# EAGLE design drawerlights (EAGLE 8.7.1)
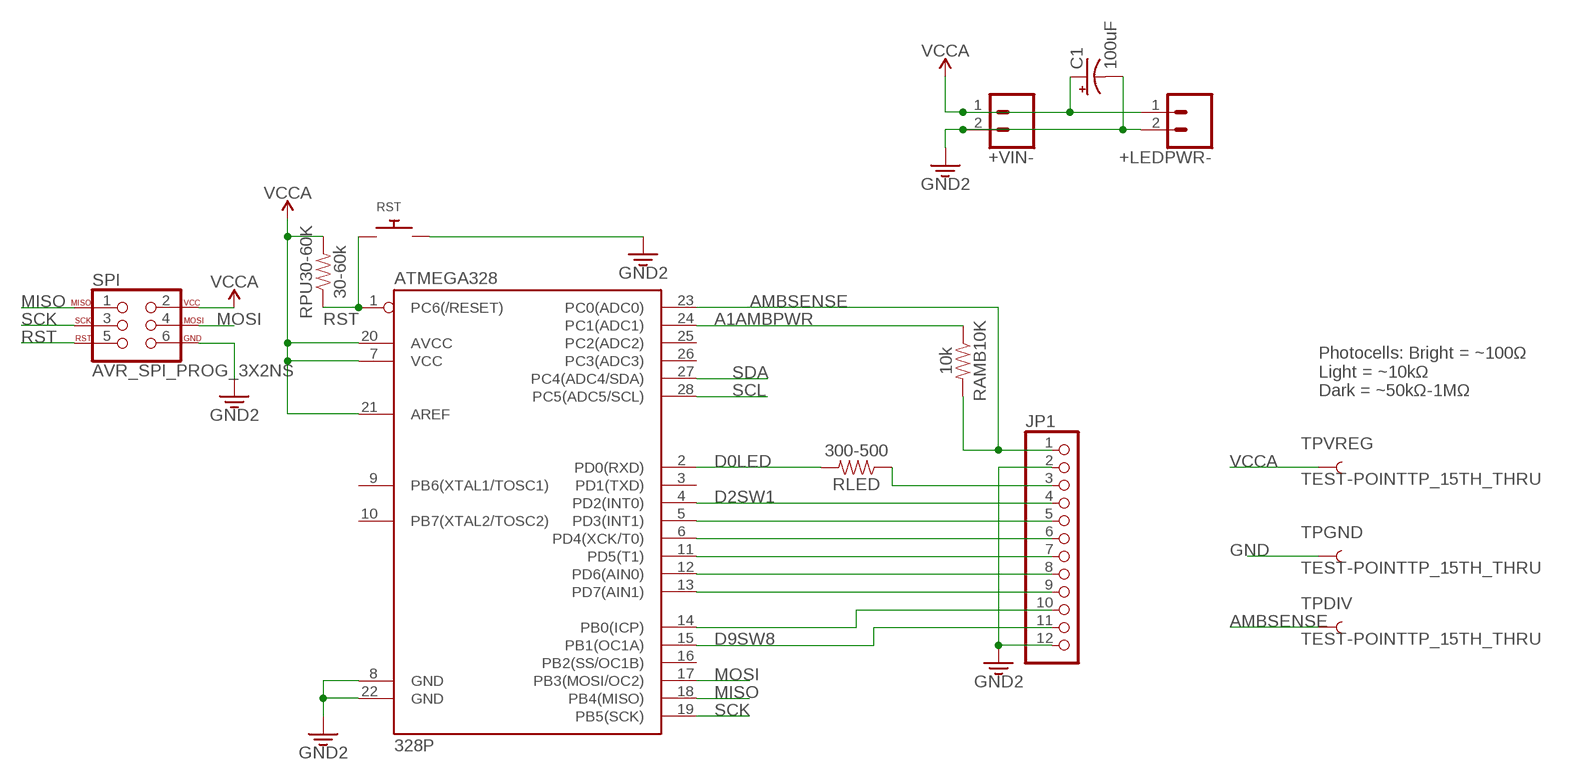
[diagram p0: schematic, sheet 1]

## Parts
+LEDPWR-  CONN_02  [1X02]
+VIN-  CONN_02  [1X02]
ATMEGA328  328P  ATMEGA328P_PDIP  [DIP28]
C1  100uF  100UF-POLAR-RADIAL-2.5MM-25V-20%  [CPOL-RADIAL-2.5MM-6.5MM]
JP1  PINHD-1X12-CB  [1X12-CB]
RAMB10K  10k  10KOHM-HORIZ-1/4W-1%  [AXIAL-0.3]
RLED  300-500  330OHM-HORIZ-1/10W-5%  [AXIAL-0.3]
RPU30-60K  30-60k  330OHM-HORIZ-1/10W-5%  [AXIAL-0.3]
RST  SWITCH_PUSHBUTTONEVQ-PE  [TACT_PANA-EVQ]
SPI  AVR_SPI_PROG_3X2NS  [2X3-NS]
TPDIV  TEST-POINTTP_15TH_THRU  [TP_15TH]
TPGND  TEST-POINTTP_15TH_THRU  [TP_15TH]
TPVREG  TEST-POINTTP_15TH_THRU  [TP_15TH]

## Nets
A1AMBPWR: ATMEGA328.24(PC1(ADC1)) RAMB10K.P$1
AMBSENSE: ATMEGA328.23(PC0(ADC0)) JP1.1 RAMB10K.P$2 TPDIV.P$1
D0LED: ATMEGA328.2(PD0(RXD)) RLED.P$2
D2SW1: ATMEGA328.4(PD2(INT0)) JP1.4
D9SW8: ATMEGA328.15(PB1(OC1A)) JP1.11
GND [power]: +LEDPWR-.2 +VIN-.2 ATMEGA328.8(GND) ATMEGA328.22(GND) C1.2(-) JP1.2 JP1.12 RST.P$2 SPI.6 TPGND.P$1 ; supply symbol labelled GND2
MISO: ATMEGA328.18(PB4(MISO)) SPI.1
MOSI: ATMEGA328.17(PB3(MOSI/OC2)) SPI.4
N$1: JP1.3 RLED.P$1
N$2: ATMEGA328.5(PD3(INT1)) JP1.5
N$3: ATMEGA328.6(PD4(XCK/T0)) JP1.6
N$4: ATMEGA328.11(PD5(T1)) JP1.7
N$5: ATMEGA328.12(PD6(AIN0)) JP1.8
N$6: ATMEGA328.13(PD7(AIN1)) JP1.9
N$7: ATMEGA328.14(PB0(ICP)) JP1.10
RST: ATMEGA328.1(PC6(/RESET)) RPU30-60K.P$1 RST.P$1 SPI.5
SCK: ATMEGA328.19(PB5(SCK)) SPI.3
SCL: ATMEGA328.28(PC5(ADC5/SCL))
SDA: ATMEGA328.27(PC4(ADC4/SDA))
VCCA [power]: +LEDPWR-.1 +VIN-.1 ATMEGA328.7(VCC) ATMEGA328.20(AVCC) ATMEGA328.21(AREF) C1.1(+) RPU30-60K.P$2 SPI.2 TPVREG.P$1
Unconnected: ATMEGA328.3(PD1(TXD)) ATMEGA328.9(PB6(XTAL1/TOSC1)) ATMEGA328.10(PB7(XTAL2/TOSC2)) ATMEGA328.16(PB2(SS/OC1B)) ATMEGA328.25(PC2(ADC2)) ATMEGA328.26(PC3(ADC3))

## Notes on the sheet
- Photocells: Bright = ~100Ω
  Light = ~10kΩ
  Dark = ~50kΩ-1MΩ

## Library data of the parts
+LEDPWR- +VIN- = SparkFun-Connectors:CONN_02: Multi connection point. Often used as Generic Header-pin footprint for 0.1 inch spaced/style header connections On any of the 0.1 inch spaced packages, you can populate with these: Break Away Headers - Straight <https://www.sparkfun.com/products/116> (PRT-00116) Break Away Male Headers - Right Angle <https://www.sparkfun.com/products/553> (PRT-00553) Female Headers <https://www.sparkfun.com/products/115> (PRT-00115) Break Away Headers - Machine Pin <https://www.sparkfun.com/products/117> (PRT-00117) Break Away Female Headers - Swiss Machine Pin <https://www.sparkfun.com/products/743> (PRT-00743) For SCREWTERMINALS and SPRING TERMINALS visit here: Screw Terimnals on SparkFun.com <https://www.sparkfun.com/search/results?term=Screw+Terminals> (5mm/3.5mm/2.54mm spacing) This device is also useful as a general connection point to wire up your design to another part of your project. Our various solder wires solder well into these plated through hole pads. Hook-Up Wire - Assortment (Stranded, 22 AWG) <https://www.sparkfun.com/products/11375> (PRT-11375) Hook-Up Wire - Assortment (Solid Core, 22 AWG) <https://www.sparkfun.com/products/11367> (PRT-11367) View the entire wire category on our website here <https://www.sparkfun.com/categories/141> Special notes: Molex polarized connector foot print use with: PRT-08233 with associated crimp pins and housings. 2.54_SCREWTERM for use with PRT-10571. 3.5mm Screw Terminal footprints for PRT-08084 5mm Screw Terminal footprints for use with PRT-08432
ATMEGA328 = SparkFun-IC-Microcontroller:ATMEGA328P_PDIP: Atmel 328P Through hole ATMEGA328P uC used in the Arduino 32kb flash, 1k EEPROM, 2k SRAM Datasheet <http://www.sparkfun.com/datasheets/Components/SMD/ATMega328.pdf> SparkFun Products Storefront component: AVR 28 Pin 20MHz 32K 6A/D - ATMega328P <https://www.sparkfun.com/products/9061> (COM-09061) SparkFun Simon Says - Through-Hole Soldering Kit <https://www.sparkfun.com/products/10547> (KIT-10547) SparkFun Learn to Solder - Simon Says <https://www.sparkfun.com/products/13708> (KIT-13708) SparkFun BigTime Watch Kit <https://www.sparkfun.com/products/11734> (KIT-11734) SparkFun ClockIt <https://www.sparkfun.com/products/10930> (KIT-10930) SparkFun Serial Enabled LCD Kit <https://www.sparkfun.com/products/10097> (LCD-10097) SparkFun Simon Tilts - Through Hole Soldering Kit <https://www.sparkfun.com/products/12634> (KIT-12634) SparkFun Frequency Counter Kit <https://www.sparkfun.com/products/10140> (KIT-10140) FabFM Radio Kit <https://www.sparkfun.com/products/11043> (KIT-11043) SparkFun Binary Blaster Kit <https://www.sparkfun.com/products/12037> (KIT-12037) SparkFun Metro-Gnome <https://www.sparkfun.com/products/9236> (KIT-09236) ATmega328 with Arduino Optiboot (Uno) <https://www.sparkfun.com/products/10524> (DEV-10524); PROD_ID: IC-09136
C1 = SparkFun-Capacitors:100UF-POLAR: 100µF polarized capacitors A capacitor is a passive two-terminal electrical component used to store electrical energy temporarily in an electric field.; PROD_ID: CAP-08439
JP1 = adafruit:PINHD-1X12: PIN HEADER
RAMB10K = SparkFun-Resistors:10KOHM: 10kΩ resistor A resistor is a passive two-terminal electrical component that implements electrical resistance as a circuit element. Resistors act to reduce current flow, and, at the same time, act to lower voltage levels within circuits. - Wikipedia; PROD_ID: RES-12183
RLED RPU30-60K = SparkFun-Resistors:330OHM: 330Ω resistor A resistor is a passive two-terminal electrical component that implements electrical resistance as a circuit element. Resistors act to reduce current flow, and, at the same time, act to lower voltage levels within circuits. - Wikipedia; PROD_ID: RES-8371; VALUE: 330
RST = adafruit:SWITCH_PUSHBUTTON: Buttons SOFTTOUCHSMD_SJ - Soft touch temporary push button (Super Junk Akihabara) Compatible with SKPMANE010 [Mouser: 688-SKPMAN] C&K_KSS = Digikey: KSS221GLFS
SPI = SparkFun-Connectors:AVR_SPI_PROG_3X2: AVR ISP 6 Pin This is the reduced ISP connector for AVR programming. Common on Arduino. This footprint will take up less PCB space and can be used with a 10-pin to 6-pin adapter such as SKU: BOB-08508 **Special note about "TEST_POINT" package. The stop mask is on the top side, so if you want your programming test points to be on the bottom of your board, make sure to place this package on the bottom side of the board. This also ensure that the orientation to program from the bottom side will be correct. SparkFun Products: SparkFun ISP Pogo Adapter <https://www.sparkfun.com/products/11591> - NS Tiny AVR Programmer <https://www.sparkfun.com/products/11801> -PTH
TPDIV TPGND TPVREG = SparkFun-Connectors:TEST-POINT: SparkFun Test Points Bare copper test points for troubleshooting or In-Circuit-Testing. These are used by our Production team for verifying production board runs using pogo-pins on test beds. SparkFun Products: SparkFun LSM9DS1 Breakout <https://www.sparkfun.com/products/13284> SparkFun PSOC <https://www.sparkfun.com/products/13714> SparkFun Load Cell Amplifier <https://www.sparkfun.com/products/13879>

## Net classes
1 power: width 0.406 mm

## Board
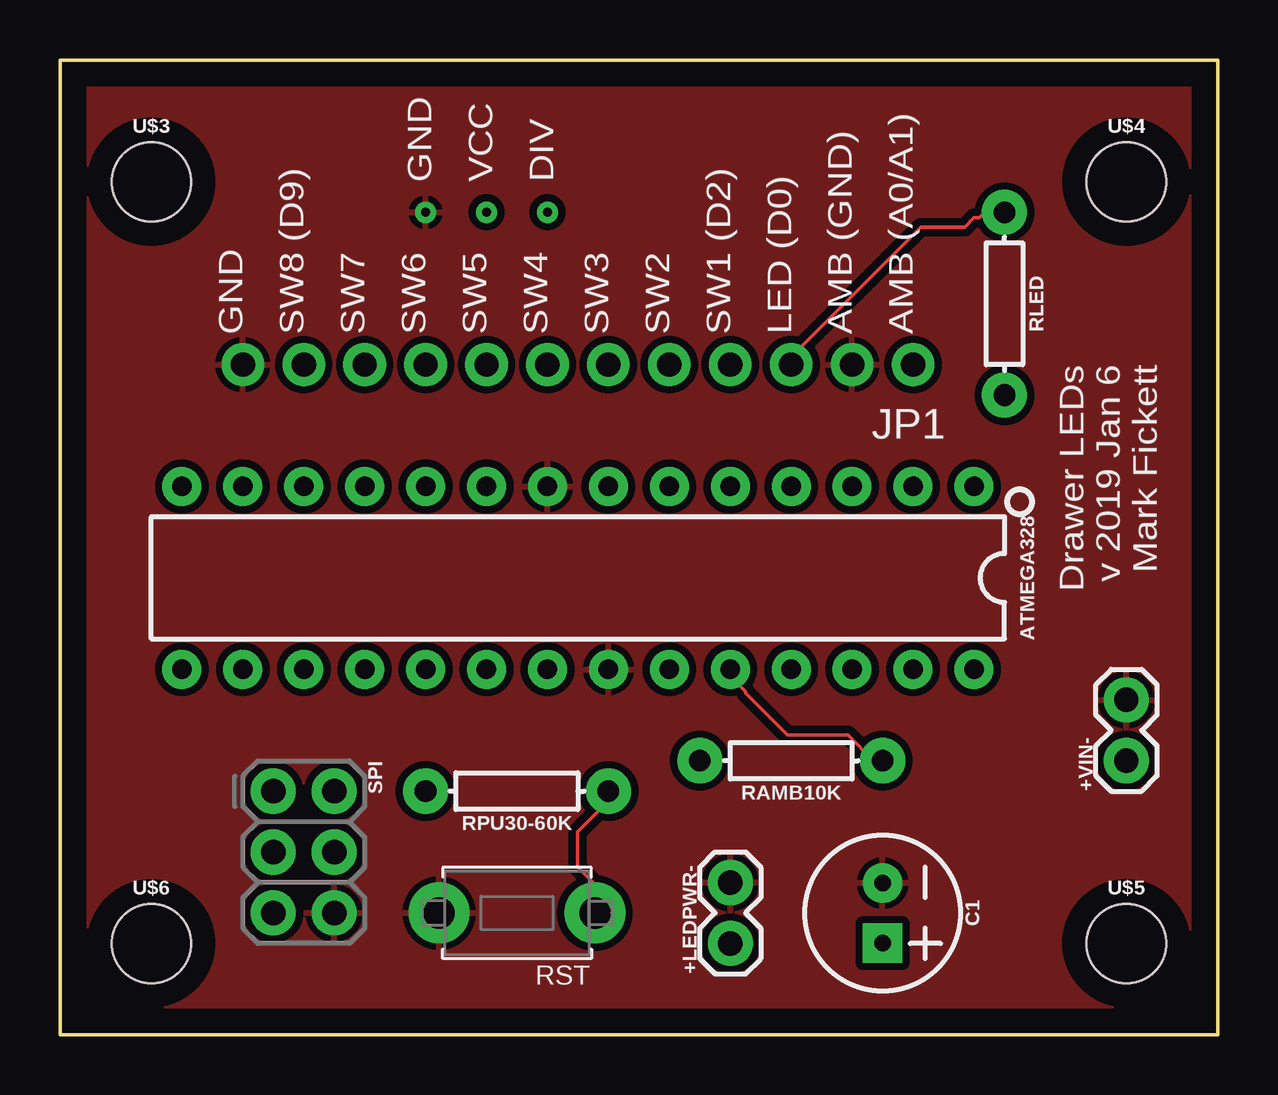
[diagram p1: board, top side]
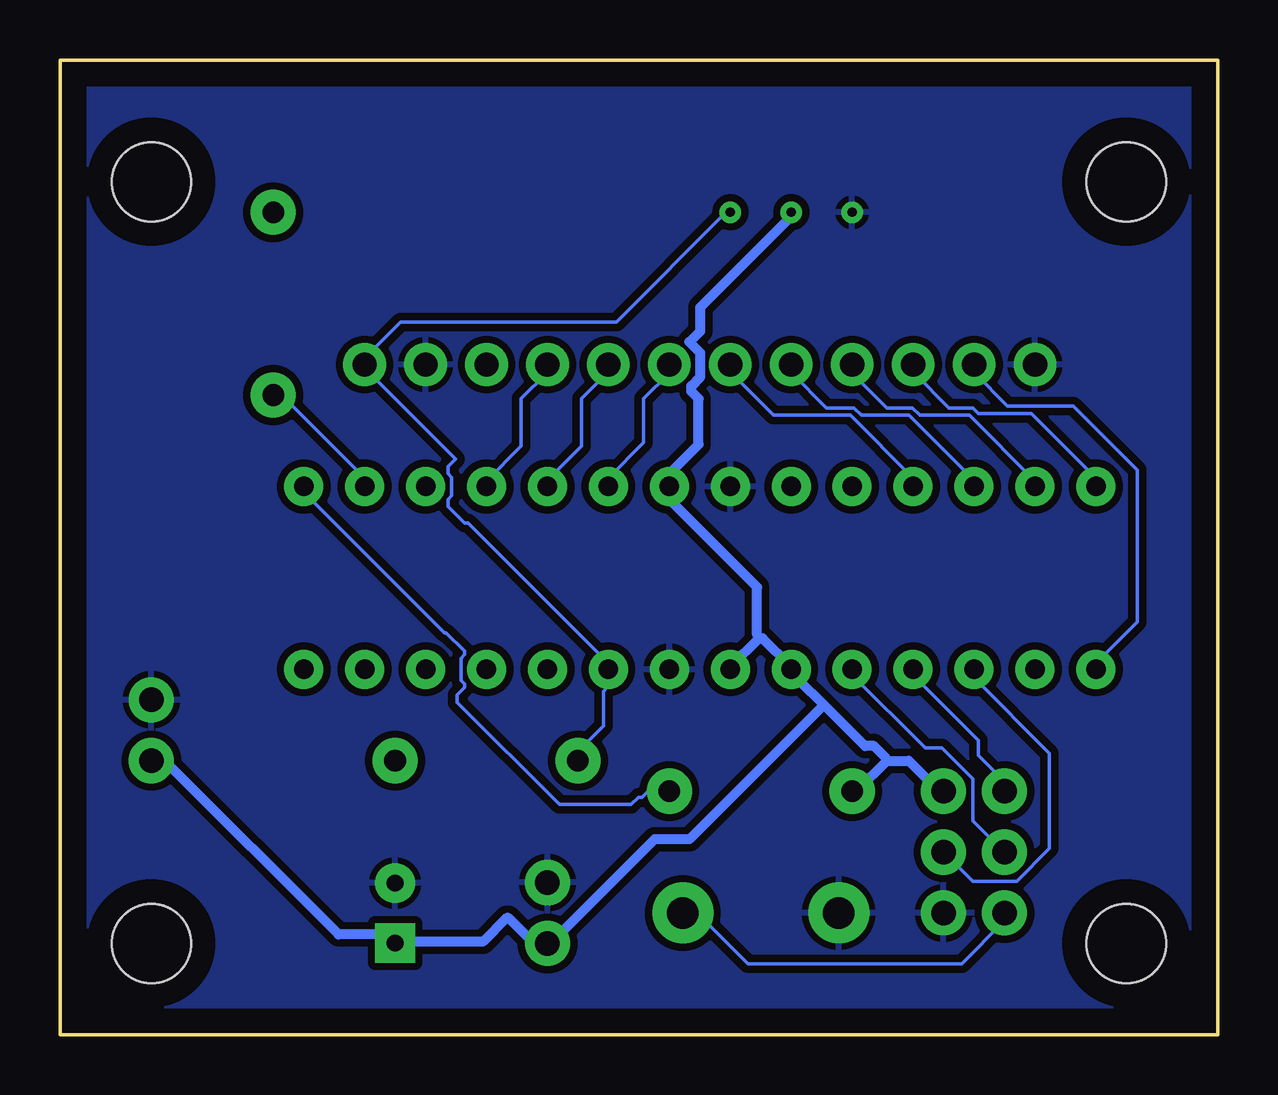
[diagram p2: board, bottom side, seen from below]

Size 48.26 x 40.64 mm. Coordinates in mm from the lower left corner, seen from the top.
Outline: 0,0 0,40.64 48.26,40.64 48.26,0 0,0
Copper layers (1*16): Top 0.035mm / dielectric 1.5mm / Bottom 0.035mm
Design rules "default": minimum track width 6mil, minimum drill 0.35mm, track to track 6mil, track to pad 6mil, pad to pad 6mil, via to via 6mil, smd to smd 6mil, copper to edge 40mil, drill to drill 6mil, minimum pad ring 10mil, minimum via ring 8mil, stop-mask expansion 4mil, vias tented up to drill 0mil, thermal gap 10mil

### Footprints (pad centres in the part's own frame; a part is rotated, then mirrored left to right if it is on the bottom)
1X02 = drill 1.016 pad 1.88: 1 0,0; 2 2.54,0
DIP28 = drill 0.813 pad 1.626: 1 -16.51,-3.81; 2 -13.97,-3.81; 3 -11.43,-3.81; 4 -8.89,-3.81; 5 -6.35,-3.81; 6 -3.81,-3.81; 7 -1.27,-3.81; 8 1.27,-3.81; 9 3.81,-3.81; 10 6.35,-3.81; 11 8.89,-3.81; 12 11.43,-3.81; 13 13.97,-3.81; 14 16.51,-3.81; 15 16.51,3.81; 16 13.97,3.81; 17 11.43,3.81; 18 8.89,3.81; 19 6.35,3.81; 20 3.81,3.81; 21 1.27,3.81; 22 -1.27,3.81; 23 -3.81,3.81; 24 -6.35,3.81; 25 -8.89,3.81; 26 -11.43,3.81; 27 -13.97,3.81; 28 -16.51,3.81
CPOL-RADIAL-2.5MM-6.5MM = drill 0.7 pad 1.651 square: 1 1.25,0 | drill 0.7 pad 1.651: 2 -1.25,0
1X12-CB = drill 1.016 pad 1.778: 1 -13.97,0; 2 -11.43,0; 3 -8.89,0; 4 -6.35,0; 5 -3.81,0; 6 -1.27,0; 7 1.27,0; 8 3.81,0; 9 6.35,0; 10 8.89,0; 11 11.43,0; 12 13.97,0
AXIAL-0.3 = drill 0.9 pad 1.88: P$1 -3.81,0; P$2 3.81,0
TACT_PANA-EVQ = drill 1.3 pad 2.54: P$1 -3.25,0; P$2 3.25,0
2X3-NS = drill 1.016 pad 1.88: 1 -2.54,-1.27; 2 -2.54,1.27; 3 0,-1.27; 4 0,1.27; 5 2.54,-1.27; 6 2.54,1.27
TP_15TH = drill 0.381 pad 0.61: P$1 0,0
STAND-OFF = hole 3.302: 0,0

### Placement (x,y rotation side)
+LEDPWR-  27.94,3.81 90 top
+VIN-  44.45,11.43 90 top
ATMEGA328  21.59,19.05 180 top
C1  34.29,5.08 270 top
JP1  21.59,27.94 180 top
RAMB10K  30.48,11.43 180 top
RLED  39.37,30.48 270 top
RPU30-60K  19.05,10.16 180 top
RST  19.05,5.08 180 top
SPI  10.16,7.62 270 top
TPDIV  20.32,34.29 0 top
TPGND  15.24,34.29 0 top
TPVREG  17.78,34.29 0 top
U$3  [STAND-OFF]  3.81,35.56 0 top
U$4  [STAND-OFF]  44.45,35.56 0 top
U$5  [STAND-OFF]  44.45,3.81 0 top
U$6  [STAND-OFF]  3.81,3.81 0 top

### Tracks (layer width: path | path; a pad name or v marks a point on that pad's centre or on a via)
A1AMBPWR
  Top 0.152: RAMB10K.P$1 33.91,11.43 32.84,12.5 30.33,12.5 28.57,14.25 28.57,14.33 27.96,14.94 27.96,15.24 ATMEGA328.24
AMBSENSE
  Bottom 0.152: 25.45,15.24 25.45,14.48 25.6,14.33 25.6,12.88 26.67,11.81 RAMB10K.P$2 | TPDIV.P$1 20.5,34.29 25.07,29.72 34.06,29.72 35.51,28.27 35.51,27.96 JP1.1 35.51,27.89 35.51,27.74 31.77,24 32.08,23.7 32.08,23.39 31.93,23.24 31.93,22.48 32.08,22.33 32.08,22.02 31.39,21.34 31.24,21.34 25.45,15.54 25.45,15.24 | 25.45,15.24 ATMEGA328.23
D0LED
  Bottom 0.152: RLED.P$2 39.01,26.67 35.59,23.24 35.59,22.86 ATMEGA328.2
D2SW1
  Bottom 0.152: ATMEGA328.4 30.48,23.09 29.03,24.54 29.03,26.52 27.96,27.58 27.96,27.89 JP1.4
D9SW8
  Bottom 0.152: ATMEGA328.15 5.03,15.24 5.03,15.54 3.35,17.22 3.35,23.55 6.02,26.21 8.76,26.21 10.13,27.58 10.13,27.89 JP1.11
GND
  pour Top (isolate 0.305): 0,40.64 48.26,40.64 48.26,0 0,0
  pour Bottom (isolate 0.305): 0,0 0,40.64 48.26,40.64 48.26,0
  pour Top (isolate 0.305): 0,40.64 48.26,40.64 48.26,0 0,0
MISO
  Bottom 0.152: ATMEGA328.18 12.65,15.24 12.65,14.94 9.98,12.27 9.98,11.66 8.91,10.59 8.91,10.21 SPI.1
MOSI
  Bottom 0.152: SPI.4 10.21,6.4 8.38,6.4 7.01,7.77 7.01,11.73 10.13,14.86 10.13,15.24 ATMEGA328.17
N$1
  Top 0.152: JP1.3 30.48,28.27 35.89,33.68 37.72,33.68 38.1,34.06 38.33,34.06 38.56,34.29 RLED.P$1
N$2
  Bottom 0.152: ATMEGA328.5 27.89,22.86 27.89,23.16 26.52,24.54 26.52,26.52 25.45,27.58 25.45,27.89 JP1.5
N$3
  Bottom 0.152: JP1.6 22.86,27.58 23.93,26.52 23.93,24.69 25.38,23.24 25.38,22.86 ATMEGA328.6
N$4
  Bottom 0.152: ATMEGA328.11 12.72,22.86 12.72,23.24 15.32,25.83 18.52,25.83 20.27,27.58 20.27,27.89 JP1.7
N$5
  Bottom 0.152: ATMEGA328.12 10.21,22.86 10.21,23.16 12.88,25.83 14.86,25.83 15.16,26.14 16.31,26.14 17.75,27.58 17.75,27.89 JP1.8
N$6
  Bottom 0.152: ATMEGA328.13 7.62,23.09 10.36,25.83 12.42,25.83 12.72,26.14 13.79,26.14 15.24,27.58 JP1.9
N$7
  Bottom 0.152: ATMEGA328.14 5.11,22.86 5.11,23.24 7.77,25.91 9.98,25.91 10.21,26.14 11.2,26.14 12.65,27.58 12.65,27.89 JP1.10
RST
  Top 0.152: RPU30-60K.P$1 22.86,9.75 21.57,8.46 21.57,7.01 22.25,6.33 22.25,5.11 RST.P$1
  Bottom 0.152: SPI.5 8.91,5.03 8.91,4.72 10.67,2.97 19.58,2.97 21.64,5.03 22.25,5.03 RST.P$1 | ATMEGA328.1 38.1,22.63 32.23,16.76 32.16,16.76 31.39,16 31.39,15.85 31.55,15.7 31.55,14.78 31.39,14.63 31.39,14.48 31.7,14.17 31.7,13.87 27.43,9.6 24.46,9.6 24.16,9.91 24,9.91 23.77,10.13 22.86,10.13 RPU30-60K.P$1
SCK
  Bottom 0.152: ATMEGA328.19 15.24,15.01 12.19,11.96 11.51,11.96 10.21,10.67 10.21,8.91 8.91,7.62 SPI.3
VCCA
  Bottom 0.406: +VIN-.1 43.89,11.43 36.65,4.19 34.67,4.19 34.44,3.96 C1.1 34.29,3.89 30.63,3.89 29.64,4.88 29.57,4.88 28.5,3.81 +LEDPWR-.1 27.81,3.96 27.66,3.96 23.47,8.15 22.02,8.15 16.42,13.75 | TPVREG.P$1 17.83,34.29 17.83,34.06 21.57,30.33 21.57,29.34 22.02,28.88 21.57,28.42 21.57,27.43 21.95,27.05 21.95,26.82 21.64,26.52 21.64,24.61 22.86,23.39 ATMEGA328.7 22.78,22.71 22.78,22.25 19.2,18.67 19.2,16.69 19.13,16.54 | 19.13,16.54 18.97,16.54 17.83,15.39 17.83,15.24 ATMEGA328.20 17.68,15.09 17.45,14.86 17.45,14.78 16.42,13.75 | 19.13,16.54 20.27,15.39 20.27,15.24 ATMEGA328.21 | 13.79,11.43 12.88,11.43 11.66,10.21 11.43,10.21 SPI.2 | 13.79,11.43 15.01,10.21 15.24,10.21 RPU30-60K.P$2 | 16.42,13.75 14.71,12.04 14.33,12.04 13.87,11.58 13.79,11.43

### Text on the board
tNames: GND / VCC / DIV | GND / SW8 (D9) / SW7 / SW6 / SW5 / SW4 / SW3 / SW2 / SW1 (D2) / LED (D0) / AMB (GND) / AMB (A0/A1) | Drawer LEDs / v 2019 Jan 6 / Mark Fickett